# Altium schematic sheet PCIe.schdoc: TEBF0808 - PCIe
size A4; DocumentNumber: TEBF0808; Revision: 04; SheetNumber: 7; SheetTotal: 36; Date: 2016-09-29; CompanyName: Trenz Electronic GmbH; Organization: Trenz Electronic GmbH
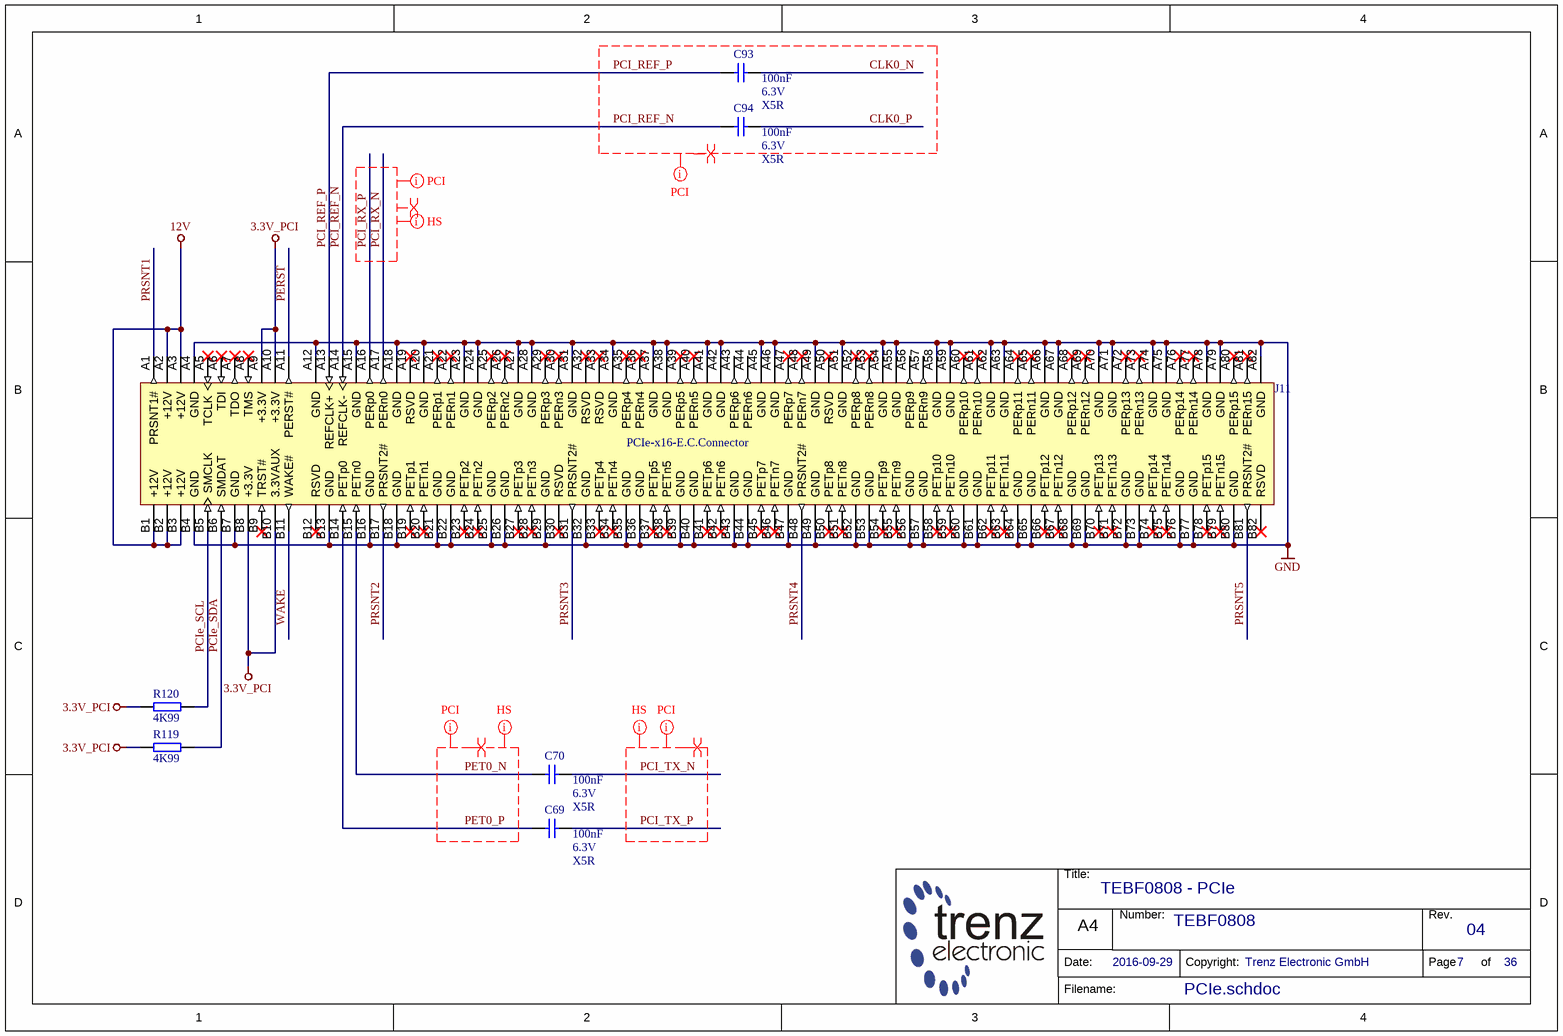
[diagram p0: PCIe.schdoc]

## Parts
C69  100nF  Voltage: 6.3V  Technology: X5R  [CAPC0603X33N]
C70  100nF  Voltage: 6.3V  Technology: X5R  [CAPC0603X33N]
C93  100nF  Voltage: 6.3V  Technology: X5R  [CAPC0603X33N]
C94  100nF  Voltage: 6.3V  Technology: X5R  [CAPC0603X33N]
J11  PCIe-x16-E.C.Connector  [PCIe-x16-E.C.Connector]
R119  4K99  [RESC1005X40N]
R120  4K99  [RESC1005X40N]

## Nets
3.3V_PCI: J11.A9(+3.3V) J11.A10(+3.3V) J11.B8(+3.3V) J11.B10(3.3VAUX) R119.1 R120.1
12V: J11.A2(+12V) J11.A3(+12V) J11.B1(+12V) J11.B2(+12V) J11.B3(+12V)
GND: J11.A4(GND) J11.A12(GND) J11.A15(GND) J11.A18(GND) J11.A20(GND) J11.A23(GND) J11.A24(GND) J11.A27(GND) J11.A28(GND) J11.A31(GND) J11.A34(GND) J11.A37(GND) J11.A38(GND) J11.A41(GND) J11.A42(GND) J11.A45(GND) J11.A46(GND) J11.A49(GND) J11.A51(GND) J11.A54(GND) J11.A55(GND) J11.A58(GND) J11.A59(GND) J11.A62(GND) J11.A63(GND) J11.A66(GND) J11.A67(GND) J11.A70(GND) J11.A71(GND) J11.A74(GND) J11.A75(GND) J11.A78(GND) J11.A79(GND) J11.A82(GND) J11.B4(GND) J11.B7(GND) J11.B13(GND) J11.B16(GND) J11.B18(GND) J11.B21(GND) J11.B22(GND) J11.B25(GND) J11.B26(GND) J11.B29(GND) J11.B32(GND) J11.B35(GND) J11.B36(GND) J11.B39(GND) J11.B40(GND) J11.B43(GND) J11.B44(GND) J11.B47(GND) J11.B49(GND) J11.B52(GND) J11.B53(GND) J11.B56(GND) J11.B57(GND) J11.B60(GND) J11.B61(GND) J11.B64(GND) J11.B65(GND) J11.B68(GND) J11.B69(GND) J11.B72(GND) J11.B73(GND) J11.B76(GND) J11.B77(GND) J11.B80(GND)
CLK0_N: C93.2
CLK0_P: C94.2
PCI_REF_N: C94.1 J11.A14(REFCLK-)
PCI_REF_P: C93.1 J11.A13(REFCLK+)
PCI_RX_N: J11.A17(PERn0)
PCI_RX_P: J11.A16(PERp0)
PCI_TX_N: C70.2
PCI_TX_P: C69.2
PCIe_SCL: J11.B5(SMCLK) R120.2
PCIe_SDA: J11.B6(SMDAT) R119.2
PERST: J11.A11(PERST#)
PET0_N: C70.1 J11.B15(PETn0)
PET0_P: C69.1 J11.B14(PETp0)
PRSNT1: J11.A1(PRSNT1#)
PRSNT2: J11.B17(PRSNT2#)
PRSNT3: J11.B31(PRSNT2#)
PRSNT4: J11.B48(PRSNT2#)
PRSNT5: J11.B81(PRSNT2#)
WAKE: J11.B11(WAKE#)

Not connected (* = marked no-connect by the designer): J11 A5(TCLK)* A6(TDI)* A7(TDO)* A8(TMS)* A19(RSVD)* A21(PERp1)* A22(PERn1)* A25(PERp2)* A26(PERn2)* A29(PERp3)* A30(PERn3)* A32(RSVD)* A33(RSVD)* A35(PERp4)* A36(PERn4)* A39(PERp5)* A40(PERn5)* A43(PERp6) A44(PERn6) A47(PERp7)* A48(PERn7)* A50(RSVD)* A52(PERp8)* A53(PERn8)* A56(PERp9) A57(PERn9) A60(PERp10)* A61(PERn10)* A64(PERp11)* A65(PERn11)* A68(PERp12)* A69(PERn12)* A72(PERp13)* A73(PERn13)* A76(PERp14)* A77(PERn14)* A80(PERp15)* A81(PERn15)* B9(TRST#)* B12(RSVD)* B19(PETp1)* B20(PETn1)* B23(PETp2)* B24(PETn2)* B27(PETp3)* B28(PETn3)* B30(RSVD)* B33(PETp4)* B34(PETn4)* B37(PETp5)* B38(PETn5)* B41(PETp6)* B42(PETn6)* B45(PETp7)* B46(PETn7)* B50(PETp8)* B51(PETn8)* B54(PETp9)* B55(PETn9)* B58(PETp10)* B59(PETn10)* B62(PETp11)* B63(PETn11)* B66(PETp12)* B67(PETn12)* B70(PETp13)* B71(PETn13)* B74(PETp14)* B75(PETn14)* B78(PETp15)* B79(PETn15)* B82(RSVD)*

## Layout directives
differential pair: CLK0_N, CLK0_P, PCI_REF_N, PCI_REF_P, PCI_RX_N, PCI_RX_P, PCI_TX_N, PCI_TX_P, PET0_N, PET0_P
net class PCI: CLK0_N, CLK0_P, PCI_REF_N, PCI_REF_P, PCI_RX_N, PCI_RX_P, PCI_TX_N, PCI_TX_P, PET0_N, PET0_P
net class HS: PCI_RX_N, PCI_RX_P, PCI_TX_N, PCI_TX_P, PET0_N, PET0_P

## Notes on the sheet
- Title:
- Number:
- Rev.
- Date:
- A4
- Copyright:
- Page
- of
- Filename:

## Library data of the parts
C69 C70 C93 C94 = 24915: KON 100nF 6.3V X5R SMD 10%; AN: 24915; Mixed: SMT; Value: 100n; Preferred: Yes; Case: 0603 (0201); Tolerance: 10%
J11 = 23437: PCIe-x16, 30µin, Twin Plastic, Black; AN: 23437; Mixed: THT; Trenz-Stock: Yes; Case: PCIe-x16; HelpURL: B:\AD\adlib\datasheet\PCIe-x16-E.C.Connector
R119 R120 = 22754: WID SMD 4K99 1% 0,063W; AN: 22754; Value: 4.99K; Mixed: SMT; Preferred: Yes; Case: 1005 (0402); Tolerance: 1%; Technology: TK100